# Altium schematic sheet Integrater.SchDoc
size A; SheetNumber: 7; SheetTotal: 7
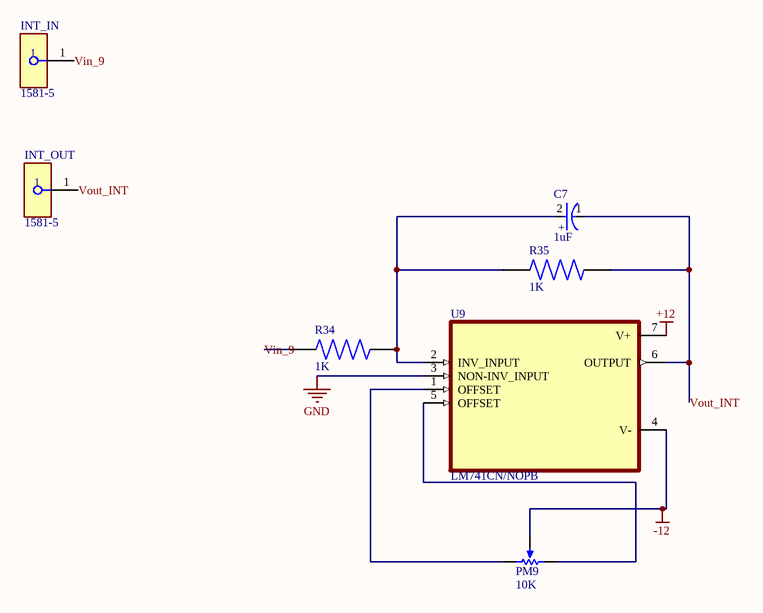
[diagram p0: Integrater.SchDoc]

## Parts
C7  1uF  [FP-ECA-2CHG010I-MFG]
INT_IN  1581-5  [FP-1581-5-MFG]
INT_OUT  1581-5  [FP-1581-5-MFG]
PM9  10K  [PCBComponent_1]
R34  1K  [RESAD1100W55L680D260]
R35  1K  [RESAD1100W55L680D260]
U9  LM741CN/NOPB  [DIP794W45P254L959H508Q8]

## Nets
+12: U9.7(V+)
-12: PM9.2(S) U9.4(V-)
GND: U9.3(NON-INV_INPUT)
Vin_9: INT_IN.1 R34.1
Vout_INT: C7.1(C) INT_OUT.1 R35.2 U9.6(OUTPUT)
NetC7_2: C7.2(A) R34.2 R35.1 U9.2(INV_INPUT)
NetPM9_1: PM9.1(CCW) U9.5(OFFSET)
NetPM9_3: PM9.3(CW) U9.1(OFFSET)

## Notes on the sheet
- (in symbol CMP-05427-002176-1) +

## Library data of the parts
C7 = CMP-05427-002176-1: CAP ALUM 1UF 20% 160V RADIAL; Lead/Base Style: Straight; Ripple Current: 17mA; Life (Hours): 2000Hour; Voltage Rating (DC): 160V; Max Operating Temperature: 105°C; Radiation Hardening: No; Min Operating Temperature: -25°C; Packaging: Ammo Pack; Series: NHG; Capacitance: 1uF; Height - Seated (Max): 0.48inch; Lead Pitch: 2.5mm; Diameter: 6.3mm; Length: 11.2mm; Package Quantity: 2000; Termination: Radial; RoHS Compliant: Yes; Voltage Rating: 160V; Tolerance: 20%; Height: 11.2mm; Case/Package: Radial; Mount: Through Hole
INT_IN INT_OUT = CMP-73906-000011-1: CONN BANANA JACK TURRET GREEN; Body Material: PC; Number of Contacts: 1; Max Current Rating: 15A; Voltage Rating (AC): 30V; Insulation: Mating End Insulated; Voltage Rating: 2.5kV; Voltage Rating (DC): 60V; Gender: Female; Height: 0.25inch; Mount: Panel; RoHS Compliant: Yes; Length: 1.22inch; Orientation: Straight; Diameter: 4.22mm; Lead Free: Lead Free; Package Quantity: 1; Termination: Turret; Current Rating: 15A; Packaging: Bag; Series: 1581; REACH SVHC: No SVHC; Number of Positions: 1; Contact Plating: Tin; Housing Color: Green; Contact Material: Brass; Insulation Material: Polycarbonate; Weight: 0.126lb; Number of Ports: 1; Color: Green; Housing Material: Polycarbonate; Width: 4inch
PM9 = Component_1
R34 R35 = MFR-25FBF52-1K: 1.07 kOhms Â±1% 0.25W, 1/4W Through Hole Resistor Axial - Metal Film; MF: Yageo; SnapEDA_Link: https://www.snapeda.com/parts/MFR-25FBF52-1K/Yageo/view-part/?ref=snap; Package: RADIAL-2 YAGEO; Value: *; MP: MFR-25FBF52-1K; Check_prices: https://www.snapeda.com/parts/MFR-25FBF52-1K/Yageo/view-part/?ref=eda
U9 = LM741CN/NOPB: Single, 44-V, 1-MHz operational amplifier; MF: Texas Instruments; SnapEDA_Link: https://www.snapeda.com/parts/LM741CN/NOPB/Texas+Instruments/view-part/?ref=snap; Package: PDIP-8 Texas; Value: *; MP: LM741CN/NOPB; Check_prices: https://www.snapeda.com/parts/LM741CN/NOPB/Texas+Instruments/view-part/?ref=eda